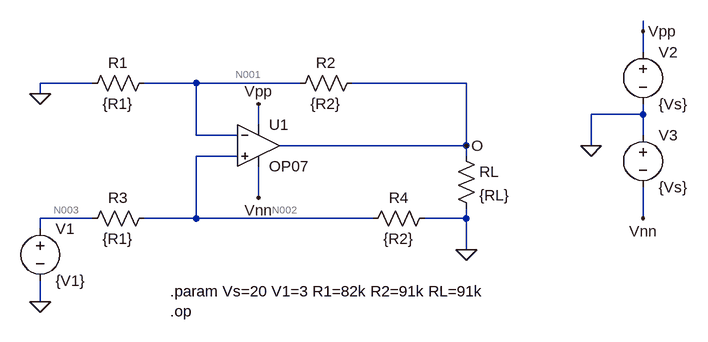
[diagram p0: schematic Q5.asc]
Q5.asc, the LTspice schematic file:
Version 4.1
SHEET 1 932 680
WIRE 848 -16 848 -32
WIRE 848 16 848 -16
WIRE 0 64 -80 64
WIRE 160 64 80 64
WIRE 320 64 160 64
WIRE 576 64 400 64
WIRE -80 80 -80 64
WIRE 848 112 848 96
WIRE 848 112 768 112
WIRE 256 128 256 96
WIRE 160 144 160 64
WIRE 224 144 160 144
WIRE 848 144 848 112
WIRE 576 160 576 64
WIRE 576 160 288 160
WIRE 768 160 768 112
WIRE 224 176 160 176
WIRE 576 176 576 160
WIRE 256 240 256 192
WIRE 0 272 -80 272
WIRE 160 272 160 176
WIRE 160 272 80 272
WIRE 432 272 160 272
WIRE 576 272 576 256
WIRE 576 272 512 272
WIRE 848 272 848 224
WIRE -80 288 -80 272
WIRE 576 320 576 272
WIRE -80 400 -80 368
FLAG -80 80 0
FLAG 256 96 Vpp
FLAG 256 240 Vnn
FLAG -80 400 0
FLAG 576 320 0
FLAG 576 160 O
FLAG 768 160 0
FLAG 848 -16 Vpp
FLAG 848 272 Vnn
SYMBOL res 96 48 R90
WINDOW 0 0 56 VBottom 2
WINDOW 3 32 56 VTop 2
SYMATTR InstName R1
SYMATTR Value {R1}
SYMBOL OpAmps\\OP07 256 96 R0
SYMATTR InstName U1
SYMBOL res 96 256 R90
WINDOW 0 0 56 VBottom 2
WINDOW 3 32 56 VTop 2
SYMATTR InstName R3
SYMATTR Value {R1}
SYMBOL voltage -80 272 R0
SYMATTR InstName V1
SYMATTR Value {V1}
SYMBOL res 528 256 R90
WINDOW 0 0 56 VBottom 2
WINDOW 3 32 56 VTop 2
SYMATTR InstName R4
SYMATTR Value {R2}
SYMBOL res 416 48 R90
WINDOW 0 0 56 VBottom 2
WINDOW 3 32 56 VTop 2
SYMATTR InstName R2
SYMATTR Value {R2}
SYMBOL res 560 160 R0
SYMATTR InstName RL
SYMATTR Value {RL}
SYMBOL voltage 848 0 R0
SYMATTR InstName V2
SYMATTR Value {Vs}
SYMBOL voltage 848 128 R0
SYMATTR InstName V3
SYMATTR Value {Vs}
TEXT 120 384 Left 2 !.param Vs=20 V1=3 R1=82k R2=91k RL=91k\n.op

The netlist it stands for:
* Q5.asc
R1 N001 0 {R1}
X§U1 N002 N001 Vpp Vnn O LT1001  ; OP07, pins In+ In- V+ V- OUT
R3 N002 N003 {R1}
V1 N003 0 {V1}
R4 0 N002 {R2}
R2 O N001 {R2}
RL O 0 {RL}
V2 Vpp 0 {Vs}
V3 0 Vnn {Vs}
.param Vs=20 V1=3 R1=82k R2=91k RL=91k
.op
.lib LTC.lib
.backanno
.end

* Results of the author's LTspice run, read from the files saved beside the schematic
* Operating Point:
*   V(n002) = 1.578 V
*   V(vnn) = -20 V
*   V(o) = 3.329 V
*   V(n001) = 1.578 V
*   V(vpp) = 20 V
*   V(n003) = 3 V
*   I(R4) = -17.34 µA
*   I(RL) = 36.59 µA
*   I(R1) = 19.24 µA
*   I(V2) = -2.278 mA
*   I(R3) = -17.34 µA
*   I(V1) = -17.34 µA
*   I(R2) = 19.24 µA
*   I(V3) = -2.222 mA
*   Ix(u1:1) = 2.878 pA
*   Ix(u1:2) = 2.758 pA
*   Ix(u1:3) = 2.278 mA
*   Ix(u1:4) = -2.222 mA
*   Ix(u1:5) = -55.83 µA